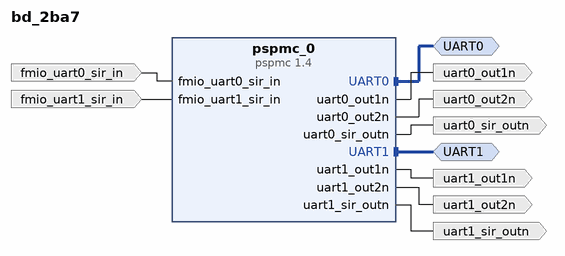
[diagram p0: block diagram of the top level]
# Vivado block design bd_2ba7, xcvc1902-vsva2197-2MP-e-S, Vivado 2023.2
create_bd_design bd_2ba7

create_bd_intf_port -mode Master -vlnv xilinx.com:interface:uart_rtl:1.0 UART0
create_bd_intf_port -mode Master -vlnv xilinx.com:interface:uart_rtl:1.0 UART1
create_bd_port -dir O uart0_sir_outn
create_bd_port -dir O uart0_out2n
create_bd_port -dir O uart0_out1n
create_bd_port -dir I fmio_uart0_sir_in
create_bd_port -dir O uart1_sir_outn
create_bd_port -dir O uart1_out2n
create_bd_port -dir O uart1_out1n
create_bd_port -dir I fmio_uart1_sir_in

create_bd_cell -type ip -vlnv xilinx.com:ip:pspmc:1.4 pspmc_0
